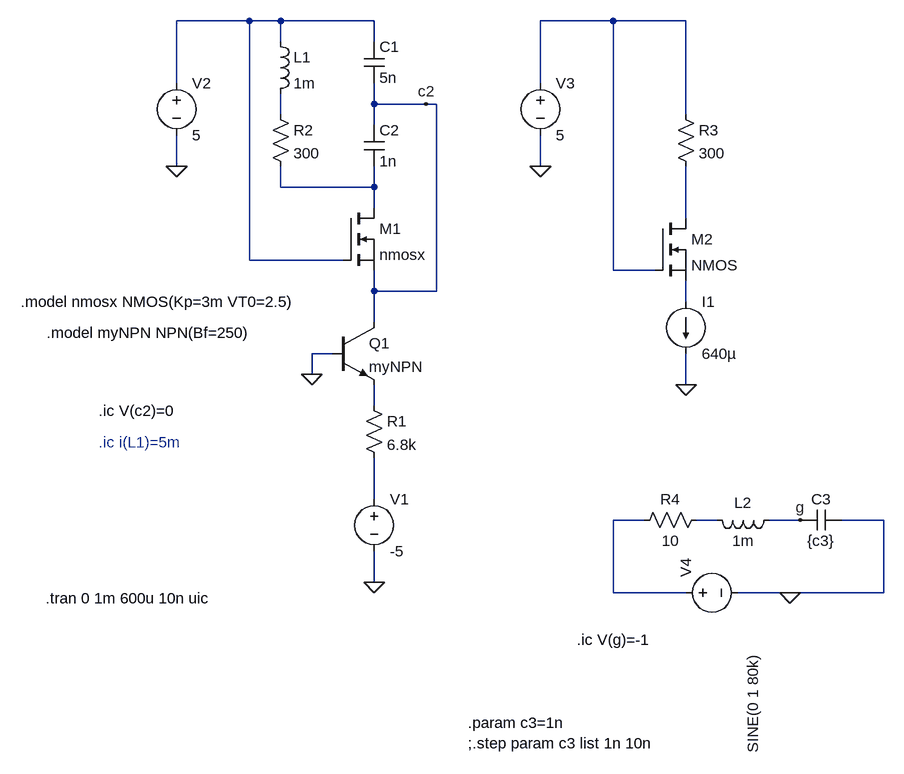
[diagram p0: schematic collpits.asc]
collpits.asc, the LTspice schematic file:
Version 4
SHEET 1 1140 796
WIRE 160 -336 48 -336
WIRE 208 -336 160 -336
WIRE 352 -336 208 -336
WIRE 720 -336 608 -336
WIRE 832 -336 720 -336
WIRE 208 -304 208 -336
WIRE 352 -304 352 -336
WIRE 48 -240 48 -336
WIRE 608 -240 608 -336
WIRE 352 -208 352 -240
WIRE 432 -208 352 -208
WIRE 448 -208 432 -208
WIRE 208 -192 208 -224
WIRE 832 -192 832 -336
WIRE 352 -176 352 -208
WIRE 48 -112 48 -160
WIRE 608 -112 608 -160
WIRE 208 -80 208 -112
WIRE 352 -80 352 -112
WIRE 352 -80 208 -80
WIRE 352 -48 352 -80
WIRE 832 -32 832 -112
WIRE 160 32 160 -336
WIRE 304 32 160 32
WIRE 720 48 720 -336
WIRE 784 48 720 48
WIRE 352 80 352 48
WIRE 448 80 448 -208
WIRE 448 80 352 80
WIRE 832 96 832 64
WIRE 352 128 352 80
WIRE 288 176 256 176
WIRE 256 208 256 176
WIRE 832 224 832 176
WIRE 352 256 352 224
WIRE 352 400 352 336
WIRE 768 432 720 432
WIRE 880 432 848 432
WIRE 1008 432 960 432
WIRE 1136 432 1072 432
WIRE 352 528 352 480
WIRE 720 544 720 432
WIRE 832 544 720 544
WIRE 992 544 912 544
WIRE 1136 544 1136 432
WIRE 1136 544 992 544
FLAG 352 528 0
FLAG 48 -112 0
FLAG 256 208 0
FLAG 608 -112 0
FLAG 832 224 0
FLAG 432 -208 c2
FLAG 992 544 0
FLAG 1008 432 g
SYMBOL voltage 352 384 R0
WINDOW 123 0 0 Left 2
WINDOW 39 0 0 Left 2
SYMATTR InstName V1
SYMATTR Value -5
SYMBOL res 336 240 R0
SYMATTR InstName R1
SYMATTR Value 6.8k
SYMBOL res 192 -208 R0
SYMATTR InstName R2
SYMATTR Value 300
SYMBOL npn 288 128 R0
SYMATTR InstName Q1
SYMATTR Value myNPN
SYMBOL nmos 304 -48 R0
SYMATTR InstName M1
SYMATTR Value nmosx
SYMBOL ind 192 -320 R0
SYMATTR InstName L1
SYMATTR Value 1m
SYMBOL cap 336 -304 R0
SYMATTR InstName C1
SYMATTR Value 5n
SYMBOL cap 336 -176 R0
SYMATTR InstName C2
SYMATTR Value 1n
SYMBOL voltage 48 -256 R0
WINDOW 123 0 0 Left 2
WINDOW 39 0 0 Left 2
SYMATTR InstName V2
SYMATTR Value 5
SYMBOL res 816 -208 R0
SYMATTR InstName R3
SYMATTR Value 300
SYMBOL nmos 784 -32 R0
SYMATTR InstName M2
SYMBOL voltage 608 -256 R0
WINDOW 123 0 0 Left 2
WINDOW 39 0 0 Left 2
SYMATTR InstName V3
SYMATTR Value 5
SYMBOL current 832 96 R0
WINDOW 123 0 0 Left 2
WINDOW 39 0 0 Left 2
SYMATTR InstName I1
SYMATTR Value 640µ
SYMBOL ind 976 416 R90
WINDOW 0 5 56 VBottom 2
WINDOW 3 32 56 VTop 2
SYMATTR InstName L2
SYMATTR Value 1m
SYMBOL cap 1072 416 R90
WINDOW 0 0 32 VBottom 2
WINDOW 3 32 32 VTop 2
SYMATTR InstName C3
SYMATTR Value {c3}
SYMBOL res 864 416 R90
WINDOW 0 0 56 VBottom 2
WINDOW 3 32 56 VTop 2
SYMATTR InstName R4
SYMATTR Value 10
SYMBOL voltage 816 544 R270
WINDOW 3 -247 119 Left 2
WINDOW 123 0 0 Left 2
WINDOW 39 0 0 Left 2
SYMATTR InstName V4
SYMATTR Value SINE(0 1 80k)
TEXT -152 144 Left 2 !.model myNPN NPN(Bf=250)
TEXT -154 552 Left 2 !.tran 0 1m 600u 10n uic
TEXT -72 264 Left 2 !.ic V(c2)=0
TEXT -192 96 Left 2 !.model nmosx NMOS(Kp=3m VT0=2.5)
TEXT -72 312 Left 2 ;.ic i(L1)=5m
TEXT 664 616 Left 2 !.ic V(g)=-1
TEXT 496 744 Left 2 !.param c3=1n\n;.step param c3 list 1n 10n

The netlist it stands for:
* collpits.asc
V1 N008 0 -5
R1 N007 N008 6.8k
R2 N003 N004 300
Q1 c2 0 N007 0 myNPN
M1 N004 N001 c2 c2 nmosx
L1 N001 N003 1m
C1 N001 c2 5n
C2 c2 N004 1n
V2 N001 0 5
R3 N002 N005 300
M2 N005 N002 N006 N006 NMOS
V3 N002 0 5
I1 N006 0 640µ
L2 g N010 1m
C3 0 g {c3}
R4 N010 N009 10
V4 N009 0 SINE(0 1 80k)
.model NPN NPN
.model PNP PNP
.lib standard.bjt
.model NMOS NMOS
.model PMOS PMOS
.lib standard.mos
.model myNPN NPN(Bf=250)
.tran 0 1m 600u 10n uic
.ic V(c2)=0
.model nmosx NMOS(Kp=3m VT0=2.5)
* .ic i(L1)=5m
.ic V(g)=-1
.param c3=1n
;.step param c3 list 1n 10n
.backanno
.end